# Altium project PCB_SIM808_SmartLock.PrjPcb
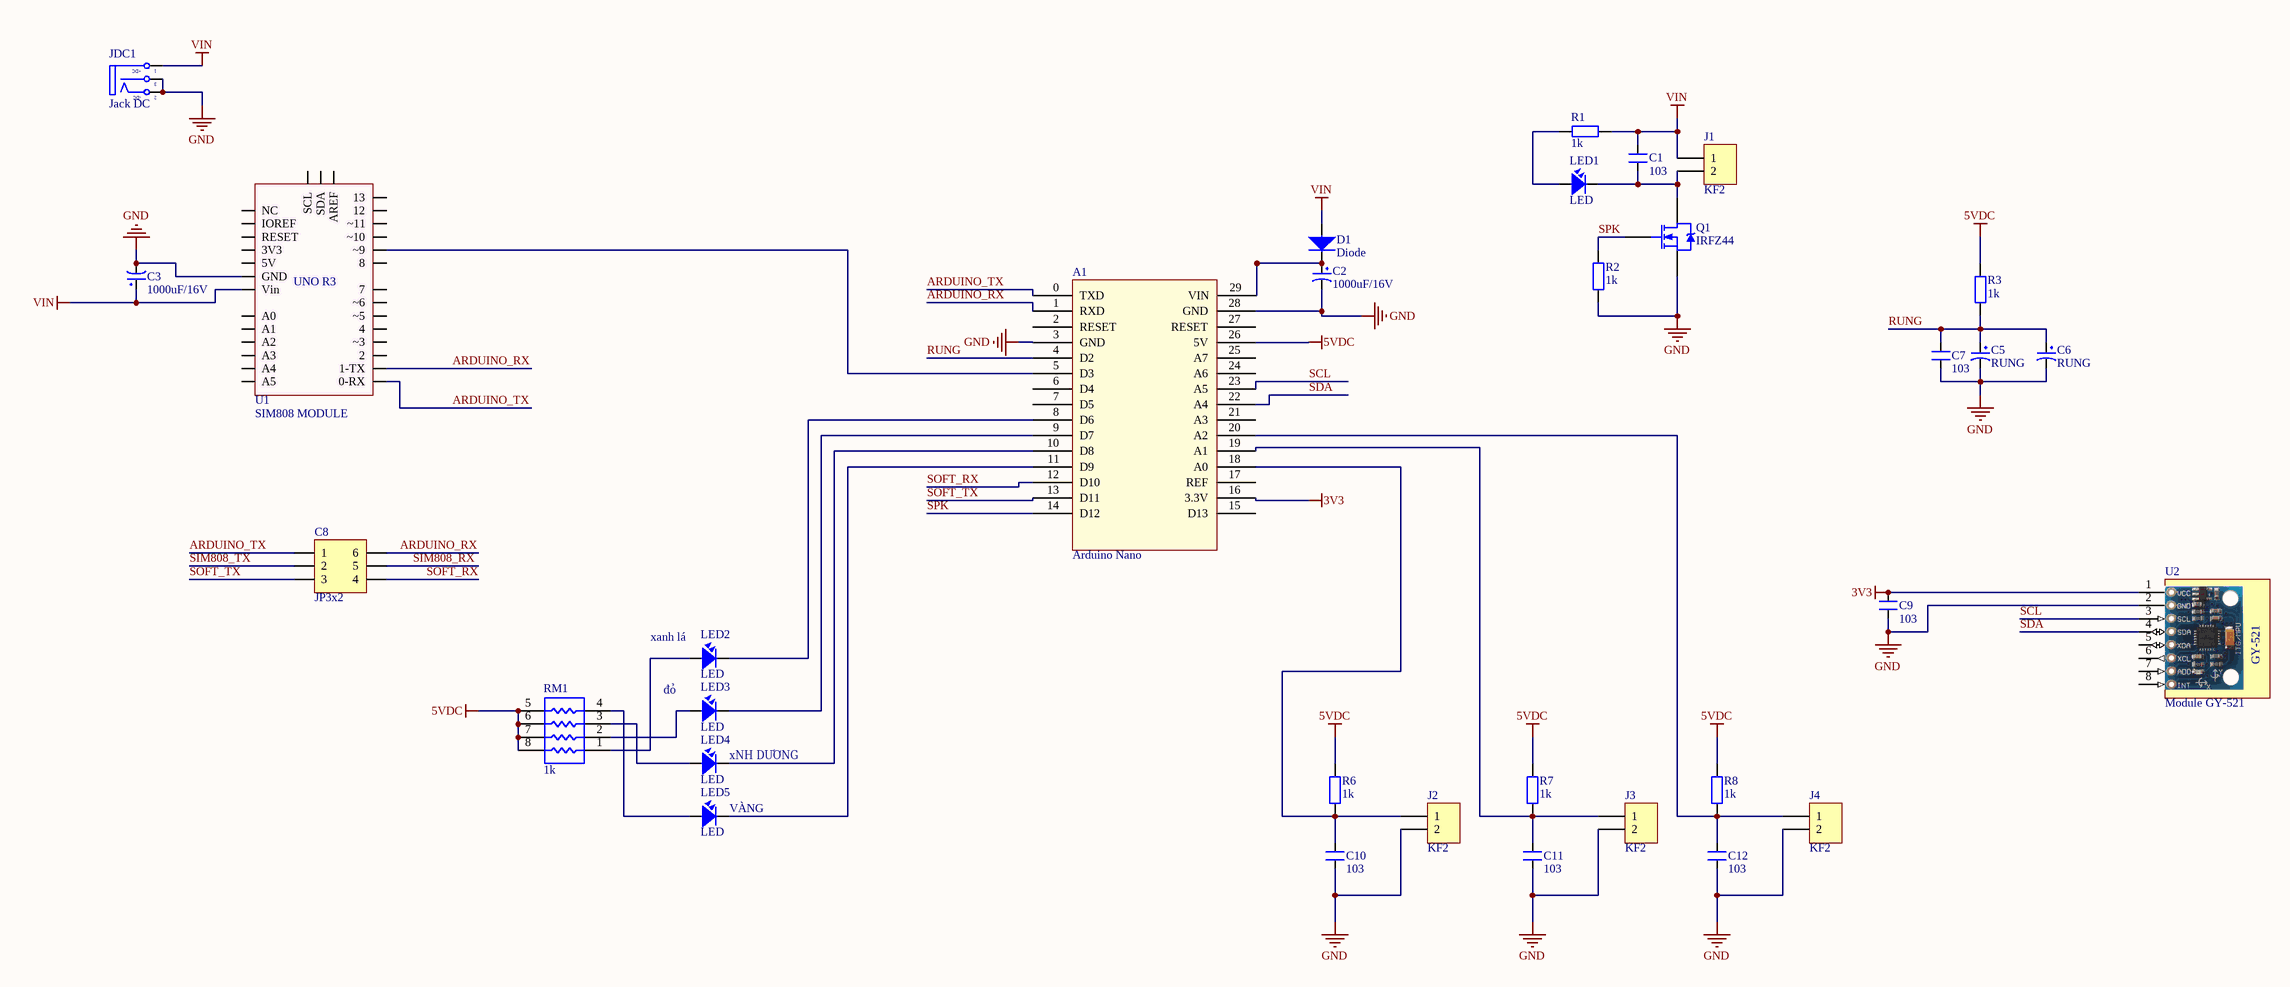
[diagram p0: SIM808_SmartLock.SchDoc]
1 sheet, 33 parts. Net scope: global (net labels, ports and power ports of the same name join across sheets).
Board file: SIM808_SmartLock.PcbDoc

## Sheet SIM808_SmartLock.SchDoc
size A0

### Parts
A1  Arduino Nano  [Arduino Nano]
C1  103  [SM-0805]
C2  1000uF/16V  [CP1.5/3.4]
C3  1000uF/16V  [CP1.5/3.4]
C5  RUNG  [CP1.5/3.4]
C6  RUNG  [CP1.5/3.4]
C7  103  [SM-0805]
C8  JP3x2  [JP3-D2T]
C9  103  [SM-0805]
C10  103  [SM-0805]
C11  103  [SM-0805]
C12  103  [SM-0805]
D1  Diode  [DIO-SMD-106]
J1  KF2  [KF2-5.08]
J2  KF2  [KF2-5.08]
J3  KF2  [KF2-5.08]
J4  KF2  [KF2-5.08]
JDC1  Jack DC  [DC0]
LED1  LED  [LED-5-BLUE]
LED2  LED  [LED-5-BLUE]
LED3  LED  [LED-5-BLUE]
LED4  LED  [LED-5-BLUE]
LED5  LED  [LED-5-BLUE]
Q1  IRFZ44  [TO252-123]
R1  1k  [RES-1/4W]
R2  1k  [RES-1/4W]
R3  1k  [RES-1/4W]
R6  1k  [RES-1/4W]
R7  1k  [RES-1/4W]
R8  1k  [RES-1/4W]
RM1  1k  [RN4-0805]
U1  SIM808 MODULE  [Arduino UNO R3]
U2  Module GY-521  [MODULE GY-9150]

### Nets
3V3: A1.16(3.3V) C9.2 U2.1(VCC)
5VDC: A1.26(5V) R3.2 R6.2 R7.2 R8.2 RM1.5 RM1.6 RM1.7 RM1.8
GND: A1.3(GND) A1.28(GND) C2.2 C3.2 C5.2 C6.2 C7.1 C9.1 C10.1 C11.1 C12.1 J2.2 J3.2 J4.2 JDC1.2(TN) JDC1.3(S) Q1.3(S) R2.1 U1.GND U2.2(GND)
VIN: C1.2 C3.1 D1.1 J1.1 JDC1.1(T) R1.2 U1.Vin
ARDUINO_RX: A1.1(RXD) C8.6 U1.1-TX
ARDUINO_TX: A1.0(TXD) C8.1 U1.0-RX
RUNG: A1.4(D2) C5.1 C6.1 C7.2 R3.1
SCL: A1.23(A5) U2.3(SCL)
SDA: A1.22(A4) U2.4(SDA)
SIM808_RX: C8.5
SIM808_TX: C8.2
SOFT_RX: A1.12(D10) C8.4
SOFT_TX: A1.13(D11) C8.3
SPK: A1.14(D12) Q1.1(G) R2.2
NetA1_5: A1.5(D3) U1.~9
NetA1_8: A1.8(D6) LED2.2
NetA1_9: A1.9(D7) LED3.2
NetA1_10: A1.10(D8) LED4.2
NetA1_11: A1.11(D9) LED5.2
NetA1_18: A1.18(A0) C10.2 J2.1 R6.1
NetA1_19: A1.19(A1) C11.2 J3.1 R7.1
NetA1_20: A1.20(A2) C12.2 J4.1 R8.1
NetA1_29: A1.29(VIN) C2.1 D1.2
NetC1_1: C1.1 J1.2 LED1.2 Q1.2(D)
NetLED1_1: LED1.1 R1.1
NetLED2_1: LED2.1 RM1.1
NetLED3_1: LED3.1 RM1.2
NetLED4_1: LED4.1 RM1.3
NetLED5_1: LED5.1 RM1.4

Not connected (* = marked no-connect by the designer): A1 2(RESET) 6(D4) 7(D5) 15(D13) 17(REF) 21(A3) 24(A6) 25(A7) 27(RESET); U1 2 3V3 4 5V 7 8 12 13 A0 A1 A2 A3 A4 A5 AREF IOREF NC RESET SCL SDA ~3 ~5 ~6 ~10 ~11; U2 5(XDA) 6(XCL) 7(ADO) 8(INT)

### Notes on the sheet
- (near LED2) xanh lá
- đỏ
- (near LED4) xNH DƯƠNG
- (near LED5) VÀNG
- (in symbol JACK_DC) +DC; -DC
- (in symbol KIT ARDUINO R3) UNO R3
- (in symbol Module GY-521) GY-521

### Library data of the parts
C1 C7 C9-C12 = CM: Cap SMD; Value: 103
C2 C3 C5 C6 = CP4: Cap 1000uF/16V - 220uF/50V; Description 5: 4,7uF>10uF/250V_3,3uF>10uF/400V - 2,2uF>4,7uF/450V; Description 1: 2200uF-3300uF/6,3V - 1000uF-2200uF/10V; Description 2: 1000uF/16V - 470uF => 1000uF/25V - 100uF/100V; Description 3: 330uF>470uF/35V_220uF>470uF/50V_10uF>22uF/250V; Description 4: 220uF => 330uF/63V - 10uF =>33uF/160 - 200V; Value: 1000uF/16V
C8 = JP3x2: WR-PHD 2.54 mm Dual Socket Header; Manufacturer: W¨¹rth Elektronik eiSos GmbH; partNo: 61300621821; ComponentLink1 Description: Manufacturer; ComponentLink2 Description: Datasheet; NoPins: 06; Created Date: 29 March 2013; ComponentLink1URL: http://www.we-online.com; ComponentLink2URL: http://katalog.we-online.de/em/datasheet/6130xx21821.pdf; Created by: Karrer Zheng
J1-J4 = KF2: Manufacturer: Würth Elektronik eiSos GmbH; partNo: 691103110002; ComponentLink1 Description: Manufacturer; ComponentLink2 Description: Datasheet; NoPins: 2; Created Date: 29 October 2013; ComponentLink1URL: http://www.we-online.com; ComponentLink2URL: http://katalog.we-online.de/em/datasheet/6911031100xx.pdf; Created by: Karrer Zheng
JDC1 = JACK_DC
Q1 = IRFZ44: Value: IRF840
R1-R3 R6-R8 = R: Resistor R1/4W
RM1 = ResPack
U1 = KIT ARDUINO R3: ARDUINO  R3 ATMEGA328, ARDUINO UNO, EVAL BOARD
U2 = Module GY-521: MPU 6050